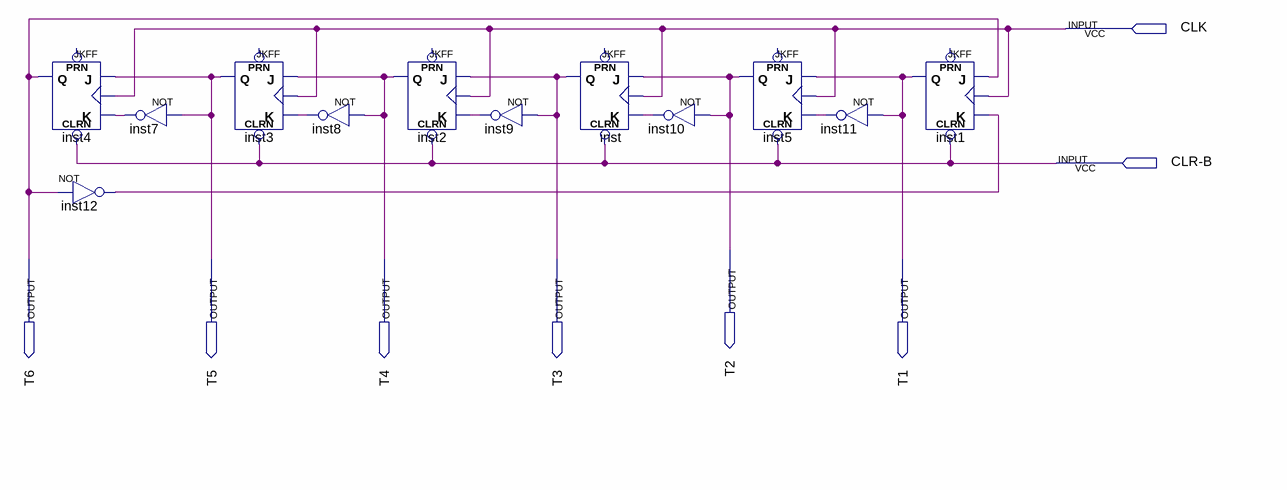
[diagram p0: schematic sheet]
// Quartus schematic Controlador_em_Anel.bdf as structural Verilog: 12 symbols, 8 pins
module Controlador_em_Anel (
  input  CLK,
  input  \CLR-B ,
  output T2,
  output T6,
  output T5,
  output T4,
  output T3,
  output T1
);

  wire inst7_out, inst8_out, inst9_out, inst10_out, inst11_out, inst12_out;

  JKFF inst4 (.CLRN(\CLR-B ), .K(inst7_out), .J(T5), .CLK(CLK), .Q(T6));  // open: PRN
  not inst7 (inst7_out, T5);
  not inst12 (inst12_out, T6);
  JKFF inst3 (.CLRN(\CLR-B ), .K(inst8_out), .J(T4), .CLK(CLK), .Q(T5));  // open: PRN
  not inst8 (inst8_out, T4);
  JKFF inst2 (.CLRN(\CLR-B ), .K(inst9_out), .J(T3), .CLK(CLK), .Q(T4));  // open: PRN
  not inst9 (inst9_out, T3);
  JKFF inst (.CLRN(\CLR-B ), .K(inst10_out), .J(T2), .CLK(CLK), .Q(T3));  // open: PRN
  not inst10 (inst10_out, T2);
  JKFF inst5 (.CLRN(\CLR-B ), .K(inst11_out), .J(T1), .CLK(CLK), .Q(T2));  // open: PRN
  not inst11 (inst11_out, T1);
  JKFF inst1 (.CLRN(\CLR-B ), .K(inst12_out), .J(T6), .CLK(CLK), .Q(T1));  // open: PRN
endmodule
